# Altium schematic sheet PixelClockPanel.SchDoc
size A2; PageSetup: Record=PageOptions|CenterHorizontal=True|CenterVertical=True|PrintScale=0.68|XCorrection=1.00|YCorrection=1.00|PrintKind=1|BorderSize=5000000|LeftOffset=0|BottomOffset=0|Orientation=2|PaperLength=1000|PaperWidth=1000|Scale=100|PaperSource=7|PrintQuality=-4|MediaType=1|DitherType=10|PrintScaleMode=1|PaperKind=A3
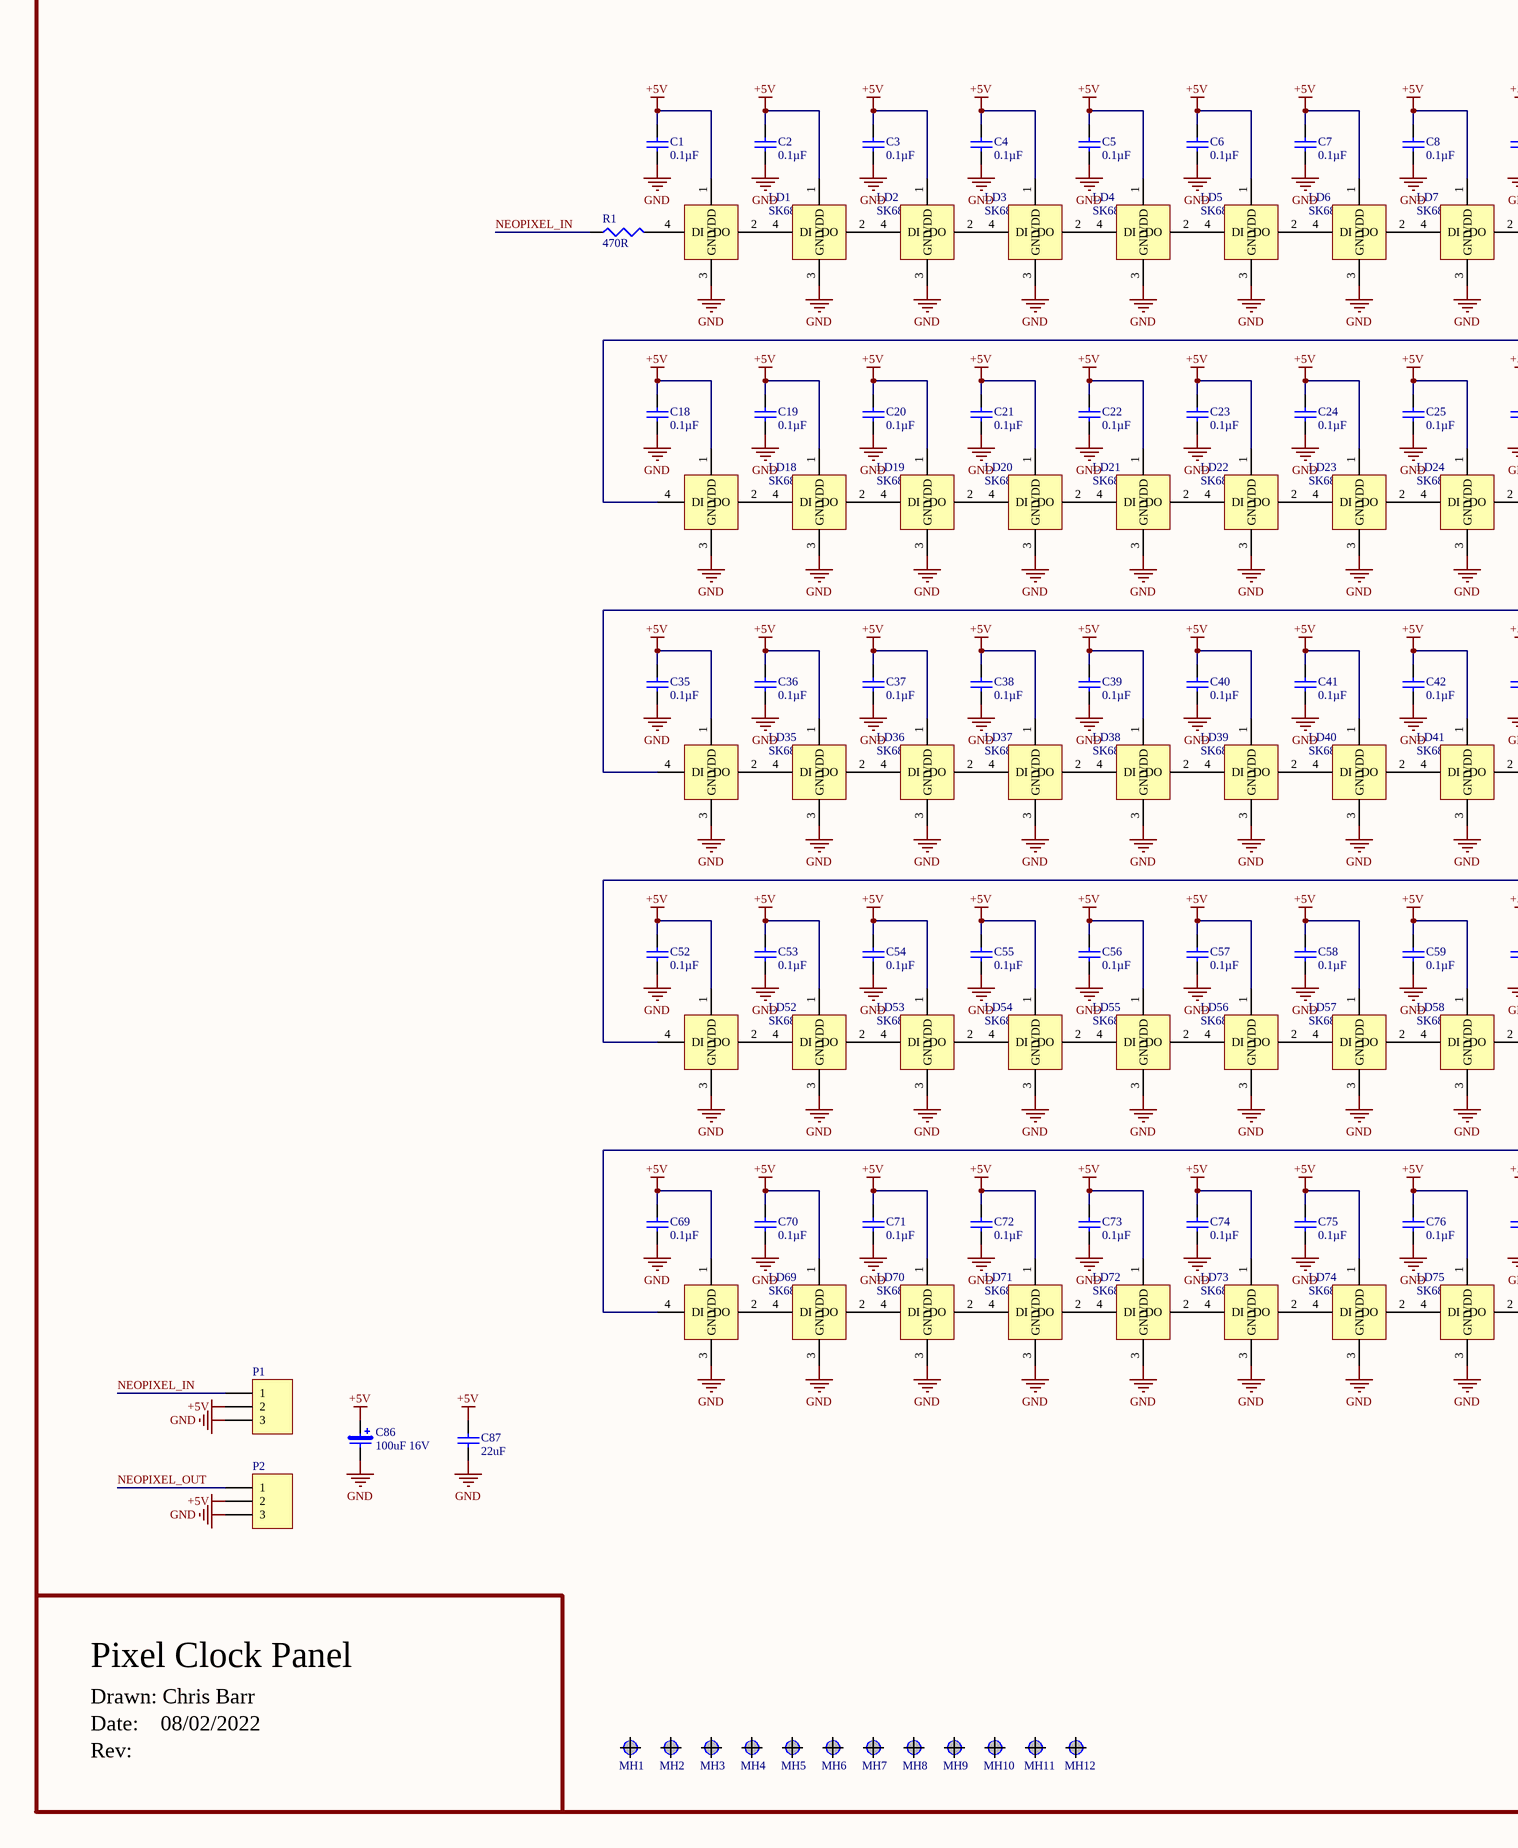
[diagram p0: PixelClockPanel.SchDoc, left]
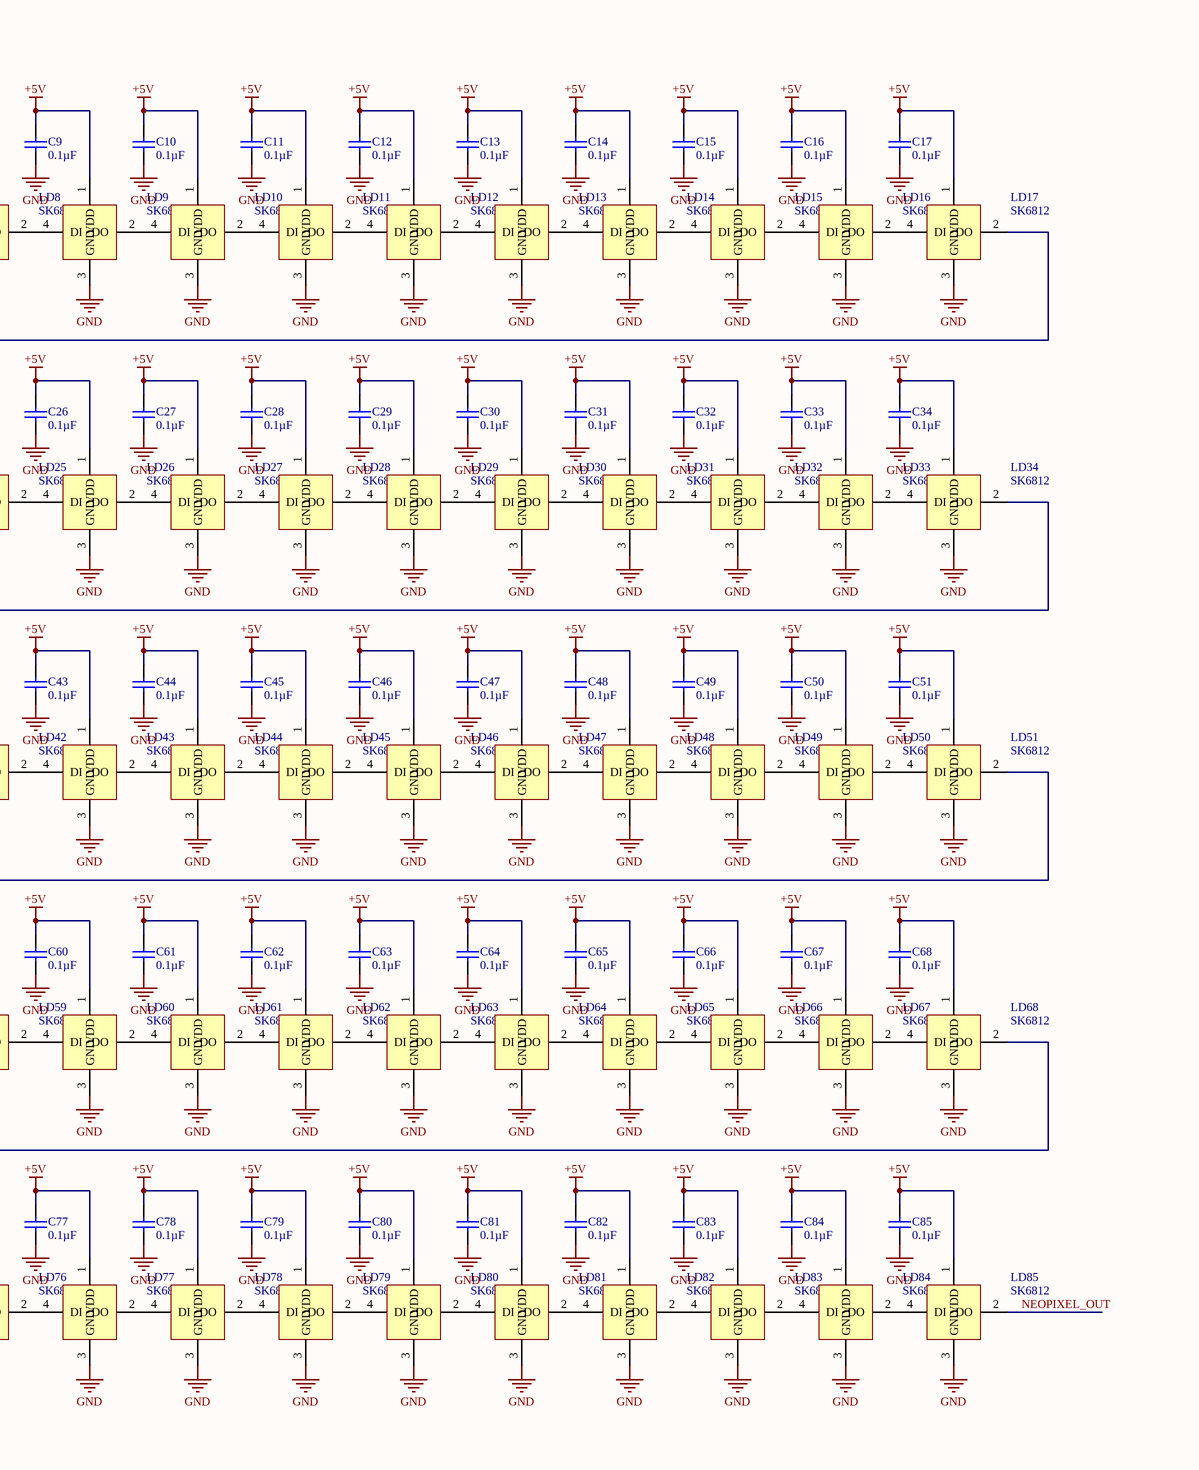
[diagram p1: PixelClockPanel.SchDoc, right]

## Parts
C1  value 0.1µF  [CAPC1608X90N]  (hidden comment: Capacitor)
C2  value 0.1µF  [CAPC1608X90N]  (hidden comment: Capacitor)
C3  value 0.1µF  [CAPC1608X90N]  (hidden comment: Capacitor)
C4  value 0.1µF  [CAPC1608X90N]  (hidden comment: Capacitor)
C5  value 0.1µF  [CAPC1608X90N]  (hidden comment: Capacitor)
C6  value 0.1µF  [CAPC1608X90N]  (hidden comment: Capacitor)
C7  value 0.1µF  [CAPC1608X90N]  (hidden comment: Capacitor)
C8  value 0.1µF  [CAPC1608X90N]  (hidden comment: Capacitor)
C9  value 0.1µF  [CAPC1608X90N]  (hidden comment: Capacitor)
C10  value 0.1µF  [CAPC1608X90N]  (hidden comment: Capacitor)
C11  value 0.1µF  [CAPC1608X90N]  (hidden comment: Capacitor)
C12  value 0.1µF  [CAPC1608X90N]  (hidden comment: Capacitor)
C13  value 0.1µF  [CAPC1608X90N]  (hidden comment: Capacitor)
C14  value 0.1µF  [CAPC1608X90N]  (hidden comment: Capacitor)
C15  value 0.1µF  [CAPC1608X90N]  (hidden comment: Capacitor)
C16  value 0.1µF  [CAPC1608X90N]  (hidden comment: Capacitor)
C17  value 0.1µF  [CAPC1608X90N]  (hidden comment: Capacitor)
C18  value 0.1µF  [CAPC1608X90N]  (hidden comment: Capacitor)
C19  value 0.1µF  [CAPC1608X90N]  (hidden comment: Capacitor)
C20  value 0.1µF  [CAPC1608X90N]  (hidden comment: Capacitor)
C21  value 0.1µF  [CAPC1608X90N]  (hidden comment: Capacitor)
C22  value 0.1µF  [CAPC1608X90N]  (hidden comment: Capacitor)
C23  value 0.1µF  [CAPC1608X90N]  (hidden comment: Capacitor)
C24  value 0.1µF  [CAPC1608X90N]  (hidden comment: Capacitor)
C25  value 0.1µF  [CAPC1608X90N]  (hidden comment: Capacitor)
C26  value 0.1µF  [CAPC1608X90N]  (hidden comment: Capacitor)
C27  value 0.1µF  [CAPC1608X90N]  (hidden comment: Capacitor)
C28  value 0.1µF  [CAPC1608X90N]  (hidden comment: Capacitor)
C29  value 0.1µF  [CAPC1608X90N]  (hidden comment: Capacitor)
C30  value 0.1µF  [CAPC1608X90N]  (hidden comment: Capacitor)
C31  value 0.1µF  [CAPC1608X90N]  (hidden comment: Capacitor)
C32  value 0.1µF  [CAPC1608X90N]  (hidden comment: Capacitor)
C33  value 0.1µF  [CAPC1608X90N]  (hidden comment: Capacitor)
C34  value 0.1µF  [CAPC1608X90N]  (hidden comment: Capacitor)
C35  value 0.1µF  [CAPC1608X90N]  (hidden comment: Capacitor)
C36  value 0.1µF  [CAPC1608X90N]  (hidden comment: Capacitor)
C37  value 0.1µF  [CAPC1608X90N]  (hidden comment: Capacitor)
C38  value 0.1µF  [CAPC1608X90N]  (hidden comment: Capacitor)
C39  value 0.1µF  [CAPC1608X90N]  (hidden comment: Capacitor)
C40  value 0.1µF  [CAPC1608X90N]  (hidden comment: Capacitor)
C41  value 0.1µF  [CAPC1608X90N]  (hidden comment: Capacitor)
C42  value 0.1µF  [CAPC1608X90N]  (hidden comment: Capacitor)
C43  value 0.1µF  [CAPC1608X90N]  (hidden comment: Capacitor)
C44  value 0.1µF  [CAPC1608X90N]  (hidden comment: Capacitor)
C45  value 0.1µF  [CAPC1608X90N]  (hidden comment: Capacitor)
C46  value 0.1µF  [CAPC1608X90N]  (hidden comment: Capacitor)
C47  value 0.1µF  [CAPC1608X90N]  (hidden comment: Capacitor)
C48  value 0.1µF  [CAPC1608X90N]  (hidden comment: Capacitor)
C49  value 0.1µF  [CAPC1608X90N]  (hidden comment: Capacitor)
C50  value 0.1µF  [CAPC1608X90N]  (hidden comment: Capacitor)
C51  value 0.1µF  [CAPC1608X90N]  (hidden comment: Capacitor)
C52  value 0.1µF  [CAPC1608X90N]  (hidden comment: Capacitor)
C53  value 0.1µF  [CAPC1608X90N]  (hidden comment: Capacitor)
C54  value 0.1µF  [CAPC1608X90N]  (hidden comment: Capacitor)
C55  value 0.1µF  [CAPC1608X90N]  (hidden comment: Capacitor)
C56  value 0.1µF  [CAPC1608X90N]  (hidden comment: Capacitor)
C57  value 0.1µF  [CAPC1608X90N]  (hidden comment: Capacitor)
C58  value 0.1µF  [CAPC1608X90N]  (hidden comment: Capacitor)
C59  value 0.1µF  [CAPC1608X90N]  (hidden comment: Capacitor)
C60  value 0.1µF  [CAPC1608X90N]  (hidden comment: Capacitor)
C61  value 0.1µF  [CAPC1608X90N]  (hidden comment: Capacitor)
C62  value 0.1µF  [CAPC1608X90N]  (hidden comment: Capacitor)
C63  value 0.1µF  [CAPC1608X90N]  (hidden comment: Capacitor)
C64  value 0.1µF  [CAPC1608X90N]  (hidden comment: Capacitor)
C65  value 0.1µF  [CAPC1608X90N]  (hidden comment: Capacitor)
C66  value 0.1µF  [CAPC1608X90N]  (hidden comment: Capacitor)
C67  value 0.1µF  [CAPC1608X90N]  (hidden comment: Capacitor)
C68  value 0.1µF  [CAPC1608X90N]  (hidden comment: Capacitor)
C69  value 0.1µF  [CAPC1608X90N]  (hidden comment: Capacitor)
C70  value 0.1µF  [CAPC1608X90N]  (hidden comment: Capacitor)
C71  value 0.1µF  [CAPC1608X90N]  (hidden comment: Capacitor)
C72  value 0.1µF  [CAPC1608X90N]  (hidden comment: Capacitor)
C73  value 0.1µF  [CAPC1608X90N]  (hidden comment: Capacitor)
C74  value 0.1µF  [CAPC1608X90N]  (hidden comment: Capacitor)
C75  value 0.1µF  [CAPC1608X90N]  (hidden comment: Capacitor)
C76  value 0.1µF  [CAPC1608X90N]  (hidden comment: Capacitor)
C77  value 0.1µF  [CAPC1608X90N]  (hidden comment: Capacitor)
C78  value 0.1µF  [CAPC1608X90N]  (hidden comment: Capacitor)
C79  value 0.1µF  [CAPC1608X90N]  (hidden comment: Capacitor)
C80  value 0.1µF  [CAPC1608X90N]  (hidden comment: Capacitor)
C81  value 0.1µF  [CAPC1608X90N]  (hidden comment: Capacitor)
C82  value 0.1µF  [CAPC1608X90N]  (hidden comment: Capacitor)
C83  value 0.1µF  [CAPC1608X90N]  (hidden comment: Capacitor)
C84  value 0.1µF  [CAPC1608X90N]  (hidden comment: Capacitor)
C85  value 0.1µF  [CAPC1608X90N]  (hidden comment: Capacitor)
C86  value 100uF 16V  [CAP EL PANASONIC]  (hidden comment: CapE-6.3-100uF-16V)  (no BOM)
C87  value 22uF  [CAP 3225-1210]  (hidden comment: CapC-1210-22uF-16V)  (no BOM)
LD1  SK6812  [WS2812B]
LD2  SK6812  [WS2812B]
LD3  SK6812  [WS2812B]
LD4  SK6812  [WS2812B]
LD5  SK6812  [WS2812B]
LD6  SK6812  [WS2812B]
LD7  SK6812  [WS2812B]
LD8  SK6812  [WS2812B]
LD9  SK6812  [WS2812B]
LD10  SK6812  [WS2812B]
LD11  SK6812  [WS2812B]
LD12  SK6812  [WS2812B]
LD13  SK6812  [WS2812B]
LD14  SK6812  [WS2812B]
LD15  SK6812  [WS2812B]
LD16  SK6812  [WS2812B]
LD17  SK6812  [WS2812B]
LD18  SK6812  [WS2812B]
LD19  SK6812  [WS2812B]
LD20  SK6812  [WS2812B]
LD21  SK6812  [WS2812B]
LD22  SK6812  [WS2812B]
LD23  SK6812  [WS2812B]
LD24  SK6812  [WS2812B]
LD25  SK6812  [WS2812B]
LD26  SK6812  [WS2812B]
LD27  SK6812  [WS2812B]
LD28  SK6812  [WS2812B]
LD29  SK6812  [WS2812B]
LD30  SK6812  [WS2812B]
LD31  SK6812  [WS2812B]
LD32  SK6812  [WS2812B]
LD33  SK6812  [WS2812B]
LD34  SK6812  [WS2812B]
LD35  SK6812  [WS2812B]
LD36  SK6812  [WS2812B]
LD37  SK6812  [WS2812B]
LD38  SK6812  [WS2812B]
LD39  SK6812  [WS2812B]
LD40  SK6812  [WS2812B]
LD41  SK6812  [WS2812B]
LD42  SK6812  [WS2812B]
LD43  SK6812  [WS2812B]
LD44  SK6812  [WS2812B]
LD45  SK6812  [WS2812B]
LD46  SK6812  [WS2812B]
LD47  SK6812  [WS2812B]
LD48  SK6812  [WS2812B]
LD49  SK6812  [WS2812B]
LD50  SK6812  [WS2812B]
LD51  SK6812  [WS2812B]
LD52  SK6812  [WS2812B]
LD53  SK6812  [WS2812B]
LD54  SK6812  [WS2812B]
LD55  SK6812  [WS2812B]
LD56  SK6812  [WS2812B]
LD57  SK6812  [WS2812B]
LD58  SK6812  [WS2812B]
LD59  SK6812  [WS2812B]
LD60  SK6812  [WS2812B]
LD61  SK6812  [WS2812B]
LD62  SK6812  [WS2812B]
LD63  SK6812  [WS2812B]
LD64  SK6812  [WS2812B]
LD65  SK6812  [WS2812B]
LD66  SK6812  [WS2812B]
LD67  SK6812  [WS2812B]
LD68  SK6812  [WS2812B]
LD69  SK6812  [WS2812B]
LD70  SK6812  [WS2812B]
LD71  SK6812  [WS2812B]
LD72  SK6812  [WS2812B]
LD73  SK6812  [WS2812B]
LD74  SK6812  [WS2812B]
LD75  SK6812  [WS2812B]
LD76  SK6812  [WS2812B]
LD77  SK6812  [WS2812B]
LD78  SK6812  [WS2812B]
LD79  SK6812  [WS2812B]
LD80  SK6812  [WS2812B]
LD81  SK6812  [WS2812B]
LD82  SK6812  [WS2812B]
LD83  SK6812  [WS2812B]
LD84  SK6812  [WS2812B]
LD85  SK6812  [WS2812B]
MH1  Screw Hole  [M3-Hole-2]  (value not drawn)  (no BOM)
MH2  Screw Hole  [M3-Hole-2]  (value not drawn)  (no BOM)
MH3  Screw Hole  [M3-Hole-2]  (value not drawn)  (no BOM)
MH4  Screw Hole  [M3-Hole-2]  (value not drawn)  (no BOM)
MH5  Screw Hole  [M3-Hole-2]  (value not drawn)  (no BOM)
MH6  Screw Hole  [M3-Hole-2]  (value not drawn)  (no BOM)
MH7  Screw Hole  [M3-Hole-2]  (value not drawn)  (no BOM)
MH8  Screw Hole  [M3-Hole-2]  (value not drawn)  (no BOM)
MH9  Screw Hole  [M3-Hole-2]  (value not drawn)  (no BOM)
MH10  Screw Hole  [M3-Hole-2]  (value not drawn)  (no BOM)
MH11  Screw Hole  [M3-Hole-2]  (value not drawn)  (no BOM)
MH12  Screw Hole  [M3-Hole-2]  (value not drawn)  (no BOM)
P1  Header 3  [HDR1X3-HEADER]  (value not drawn)  (no BOM)
P2  Header 3  [HDR1X3-HEADER]  (value not drawn)  (no BOM)
R1  value 470R  [RES 1608-0603]  (hidden comment: Resistor)

## Nets
+5V: C1.2 C2.2 C3.2 C4.2 C5.2 C6.2 C7.2 C8.2 C9.2 C10.2 C11.2 C12.2 C13.2 C14.2 C15.2 C16.2 C17.2 C18.2 C19.2 C20.2 C21.2 C22.2 C23.2 C24.2 C25.2 C26.2 C27.2 C28.2 C29.2 C30.2 C31.2 C32.2 C33.2 C34.2 C35.2 C36.2 C37.2 C38.2 C39.2 C40.2 C41.2 C42.2 C43.2 C44.2 C45.2 C46.2 C47.2 C48.2 C49.2 C50.2 C51.2 C52.2 C53.2 C54.2 C55.2 C56.2 C57.2 C58.2 C59.2 C60.2 C61.2 C62.2 C63.2 C64.2 C65.2 C66.2 C67.2 C68.2 C69.2 C70.2 C71.2 C72.2 C73.2 C74.2 C75.2 C76.2 C77.2 C78.2 C79.2 C80.2 C81.2 C82.2 C83.2 C84.2 C85.2 C86.1 C87.2 LD1.1(VDD) LD2.1(VDD) LD3.1(VDD) LD4.1(VDD) LD5.1(VDD) LD6.1(VDD) LD7.1(VDD) LD8.1(VDD) LD9.1(VDD) LD10.1(VDD) LD11.1(VDD) LD12.1(VDD) LD13.1(VDD) LD14.1(VDD) LD15.1(VDD) LD16.1(VDD) LD17.1(VDD) LD18.1(VDD) LD19.1(VDD) LD20.1(VDD) LD21.1(VDD) LD22.1(VDD) LD23.1(VDD) LD24.1(VDD) LD25.1(VDD) LD26.1(VDD) LD27.1(VDD) LD28.1(VDD) LD29.1(VDD) LD30.1(VDD) LD31.1(VDD) LD32.1(VDD) LD33.1(VDD) LD34.1(VDD) LD35.1(VDD) LD36.1(VDD) LD37.1(VDD) LD38.1(VDD) LD39.1(VDD) LD40.1(VDD) LD41.1(VDD) LD42.1(VDD) LD43.1(VDD) LD44.1(VDD) LD45.1(VDD) LD46.1(VDD) LD47.1(VDD) LD48.1(VDD) LD49.1(VDD) LD50.1(VDD) LD51.1(VDD) LD52.1(VDD) LD53.1(VDD) LD54.1(VDD) LD55.1(VDD) LD56.1(VDD) LD57.1(VDD) LD58.1(VDD) LD59.1(VDD) LD60.1(VDD) LD61.1(VDD) LD62.1(VDD) LD63.1(VDD) LD64.1(VDD) LD65.1(VDD) LD66.1(VDD) LD67.1(VDD) LD68.1(VDD) LD69.1(VDD) LD70.1(VDD) LD71.1(VDD) LD72.1(VDD) LD73.1(VDD) LD74.1(VDD) LD75.1(VDD) LD76.1(VDD) LD77.1(VDD) LD78.1(VDD) LD79.1(VDD) LD80.1(VDD) LD81.1(VDD) LD82.1(VDD) LD83.1(VDD) LD84.1(VDD) LD85.1(VDD) P1.2 P2.2
GND: C1.1 C2.1 C3.1 C4.1 C5.1 C6.1 C7.1 C8.1 C9.1 C10.1 C11.1 C12.1 C13.1 C14.1 C15.1 C16.1 C17.1 C18.1 C19.1 C20.1 C21.1 C22.1 C23.1 C24.1 C25.1 C26.1 C27.1 C28.1 C29.1 C30.1 C31.1 C32.1 C33.1 C34.1 C35.1 C36.1 C37.1 C38.1 C39.1 C40.1 C41.1 C42.1 C43.1 C44.1 C45.1 C46.1 C47.1 C48.1 C49.1 C50.1 C51.1 C52.1 C53.1 C54.1 C55.1 C56.1 C57.1 C58.1 C59.1 C60.1 C61.1 C62.1 C63.1 C64.1 C65.1 C66.1 C67.1 C68.1 C69.1 C70.1 C71.1 C72.1 C73.1 C74.1 C75.1 C76.1 C77.1 C78.1 C79.1 C80.1 C81.1 C82.1 C83.1 C84.1 C85.1 C86.2 C87.1 LD1.3(GND) LD2.3(GND) LD3.3(GND) LD4.3(GND) LD5.3(GND) LD6.3(GND) LD7.3(GND) LD8.3(GND) LD9.3(GND) LD10.3(GND) LD11.3(GND) LD12.3(GND) LD13.3(GND) LD14.3(GND) LD15.3(GND) LD16.3(GND) LD17.3(GND) LD18.3(GND) LD19.3(GND) LD20.3(GND) LD21.3(GND) LD22.3(GND) LD23.3(GND) LD24.3(GND) LD25.3(GND) LD26.3(GND) LD27.3(GND) LD28.3(GND) LD29.3(GND) LD30.3(GND) LD31.3(GND) LD32.3(GND) LD33.3(GND) LD34.3(GND) LD35.3(GND) LD36.3(GND) LD37.3(GND) LD38.3(GND) LD39.3(GND) LD40.3(GND) LD41.3(GND) LD42.3(GND) LD43.3(GND) LD44.3(GND) LD45.3(GND) LD46.3(GND) LD47.3(GND) LD48.3(GND) LD49.3(GND) LD50.3(GND) LD51.3(GND) LD52.3(GND) LD53.3(GND) LD54.3(GND) LD55.3(GND) LD56.3(GND) LD57.3(GND) LD58.3(GND) LD59.3(GND) LD60.3(GND) LD61.3(GND) LD62.3(GND) LD63.3(GND) LD64.3(GND) LD65.3(GND) LD66.3(GND) LD67.3(GND) LD68.3(GND) LD69.3(GND) LD70.3(GND) LD71.3(GND) LD72.3(GND) LD73.3(GND) LD74.3(GND) LD75.3(GND) LD76.3(GND) LD77.3(GND) LD78.3(GND) LD79.3(GND) LD80.3(GND) LD81.3(GND) LD82.3(GND) LD83.3(GND) LD84.3(GND) LD85.3(GND) P1.3 P2.3
NEOPIXEL_IN: P1.1 R1.1
NEOPIXEL_OUT: LD85.2(DO) P2.1
NetLD1_2: LD1.2(DO) LD2.4(DI)
NetLD1_4: LD1.4(DI) R1.2
NetLD2_2: LD2.2(DO) LD3.4(DI)
NetLD3_2: LD3.2(DO) LD4.4(DI)
NetLD4_2: LD4.2(DO) LD5.4(DI)
NetLD5_2: LD5.2(DO) LD6.4(DI)
NetLD6_2: LD6.2(DO) LD7.4(DI)
NetLD7_2: LD7.2(DO) LD8.4(DI)
NetLD8_2: LD8.2(DO) LD9.4(DI)
NetLD9_2: LD9.2(DO) LD10.4(DI)
NetLD10_2: LD10.2(DO) LD11.4(DI)
NetLD11_2: LD11.2(DO) LD12.4(DI)
NetLD12_2: LD12.2(DO) LD13.4(DI)
NetLD13_2: LD13.2(DO) LD14.4(DI)
NetLD14_2: LD14.2(DO) LD15.4(DI)
NetLD15_2: LD15.2(DO) LD16.4(DI)
NetLD16_2: LD16.2(DO) LD17.4(DI)
NetLD17_2: LD17.2(DO) LD18.4(DI)
NetLD18_2: LD18.2(DO) LD19.4(DI)
NetLD19_2: LD19.2(DO) LD20.4(DI)
NetLD20_2: LD20.2(DO) LD21.4(DI)
NetLD21_2: LD21.2(DO) LD22.4(DI)
NetLD22_2: LD22.2(DO) LD23.4(DI)
NetLD23_2: LD23.2(DO) LD24.4(DI)
NetLD24_2: LD24.2(DO) LD25.4(DI)
NetLD25_2: LD25.2(DO) LD26.4(DI)
NetLD26_2: LD26.2(DO) LD27.4(DI)
NetLD27_2: LD27.2(DO) LD28.4(DI)
NetLD28_2: LD28.2(DO) LD29.4(DI)
NetLD29_2: LD29.2(DO) LD30.4(DI)
NetLD30_2: LD30.2(DO) LD31.4(DI)
NetLD31_2: LD31.2(DO) LD32.4(DI)
NetLD32_2: LD32.2(DO) LD33.4(DI)
NetLD33_2: LD33.2(DO) LD34.4(DI)
NetLD34_2: LD34.2(DO) LD35.4(DI)
NetLD35_2: LD35.2(DO) LD36.4(DI)
NetLD36_2: LD36.2(DO) LD37.4(DI)
NetLD37_2: LD37.2(DO) LD38.4(DI)
NetLD38_2: LD38.2(DO) LD39.4(DI)
NetLD39_2: LD39.2(DO) LD40.4(DI)
NetLD40_2: LD40.2(DO) LD41.4(DI)
NetLD41_2: LD41.2(DO) LD42.4(DI)
NetLD42_2: LD42.2(DO) LD43.4(DI)
NetLD43_2: LD43.2(DO) LD44.4(DI)
NetLD44_2: LD44.2(DO) LD45.4(DI)
NetLD45_2: LD45.2(DO) LD46.4(DI)
NetLD46_2: LD46.2(DO) LD47.4(DI)
NetLD47_2: LD47.2(DO) LD48.4(DI)
NetLD48_2: LD48.2(DO) LD49.4(DI)
NetLD49_2: LD49.2(DO) LD50.4(DI)
NetLD50_2: LD50.2(DO) LD51.4(DI)
NetLD51_2: LD51.2(DO) LD52.4(DI)
NetLD52_2: LD52.2(DO) LD53.4(DI)
NetLD53_2: LD53.2(DO) LD54.4(DI)
NetLD54_2: LD54.2(DO) LD55.4(DI)
NetLD55_2: LD55.2(DO) LD56.4(DI)
NetLD56_2: LD56.2(DO) LD57.4(DI)
NetLD57_2: LD57.2(DO) LD58.4(DI)
NetLD58_2: LD58.2(DO) LD59.4(DI)
NetLD59_2: LD59.2(DO) LD60.4(DI)
NetLD60_2: LD60.2(DO) LD61.4(DI)
NetLD61_2: LD61.2(DO) LD62.4(DI)
NetLD62_2: LD62.2(DO) LD63.4(DI)
NetLD63_2: LD63.2(DO) LD64.4(DI)
NetLD64_2: LD64.2(DO) LD65.4(DI)
NetLD65_2: LD65.2(DO) LD66.4(DI)
NetLD66_2: LD66.2(DO) LD67.4(DI)
NetLD67_2: LD67.2(DO) LD68.4(DI)
NetLD68_2: LD68.2(DO) LD69.4(DI)
NetLD69_2: LD69.2(DO) LD70.4(DI)
NetLD70_2: LD70.2(DO) LD71.4(DI)
NetLD71_2: LD71.2(DO) LD72.4(DI)
NetLD72_2: LD72.2(DO) LD73.4(DI)
NetLD73_2: LD73.2(DO) LD74.4(DI)
NetLD74_2: LD74.2(DO) LD75.4(DI)
NetLD75_2: LD75.2(DO) LD76.4(DI)
NetLD76_2: LD76.2(DO) LD77.4(DI)
NetLD77_2: LD77.2(DO) LD78.4(DI)
NetLD78_2: LD78.2(DO) LD79.4(DI)
NetLD79_2: LD79.2(DO) LD80.4(DI)
NetLD80_2: LD80.2(DO) LD81.4(DI)
NetLD81_2: LD81.2(DO) LD82.4(DI)
NetLD82_2: LD82.2(DO) LD83.4(DI)
NetLD83_2: LD83.2(DO) LD84.4(DI)
NetLD84_2: LD84.2(DO) LD85.4(DI)

Not connected (* = marked no-connect by the designer): MH1 M3(0); MH2 M3(0); MH3 M3(0); MH4 M3(0); MH5 M3(0); MH6 M3(0); MH7 M3(0); MH8 M3(0); MH9 M3(0); MH10 M3(0); MH11 M3(0); MH12 M3(0)

## Notes on the sheet
- Pixel Clock Panel
- Date:    08/02/2022
- Drawn: Chris Barr
- Rev:
- Title
- Size:
- Date:
- File:
- A1
- Number:
- Time:
- Revision:
- Sheet
- of

## Library data of the parts
C1-C85 = UMJ107BB7104KAHT: CAP CER 0.1UF 50V X7R 0603; Manufacturer 1: Taiyo Yuden; Note: Approved sub OK; Tolerance: ±10%; Type: X5R; Revision: July-2002: Re-released for DXP Platform.; Voltage: 50V; Supplier 1: Digi-Key; Supplier Part Number 1: 587-4474-1-ND; Package: 0402; Manufacturer Part Number 1: UMJ107BB7104KAHT; Temperature Coefficient: X7R; Operating Temperature: -55°C ~ 125°C; Package / Case: 0603 (1608 Metric); Size / Dimension: 0.063" L x 0.031" W (1.60mm x 0.80mm); Thickness (Max): 0.039" (1.00mm)
C86 = CapE-6.3-100uF-16V: Polarized Capacitor (Surface Mount); Note: Approved sub OK; Published: 8-Jun-2000; Revision: July-2002: Re-released for DXP Platform.; Publisher: Altium Limited; Supplier 1: Digi-Key; Supplier Part Number 1: 565-2204-1-ND
C87 = CapC-1210-22uF-16V: CAP CER 22UF 16V X7R 1210; Note: Approved sub OK; Tolerance: 10%; Voltage: 25V; Revision: July-2002: Re-released for DXP Platform.; Supplier 1: Digi-Key; Supplier Part Number 1: 587-2784-1-ND; Package: 1210; Type: X7R
LD1-LD85 = LED - SK6812: LED - 5050 RGBW (Natural White); Manufacturer 1: DONGGUANG OPSCO OPTOELECTRONICS CO., LTD; Manufacturer Part Number 1: SK6812RGBW-NW
P1 P2 = Header 1X3: Header, 3-Pin; Manufacturer 1: Generic Header; Note: Approved sub OK
R1 = RC0603FR-07470RL: RES SMD 470 OHM 1% 1/10W 0603; Manufacturer 1: Yageo; Note: Approved sub OK; Power (Watts): 0.1W, 1/10W; Temperature Coefficient: ±100ppm/°C; Published: 8-Jun-2000; Revision: July-2002: Re-released for DXP Platform.; Publisher: Altium Limited; Supplier 1: Digi-Key; Supplier Part Number 1: 311-470HRCT-ND; Manufacturer Part Number 1: RC0603FR-07470RL; Tolerance: ±1%; Composition: Thick Film; Features: Moisture Resistant; Operating Temperature: -55°C ~ 155°C; Package / Case: 0603 (1608 Metric); Size / Dimension: 0.063" L x 0.031" W (1.60mm x 0.80mm); Height - Seated (Max): 0.022" (0.55mm)